# Altium schematic sheet LED_1edge.SchDoc
size A
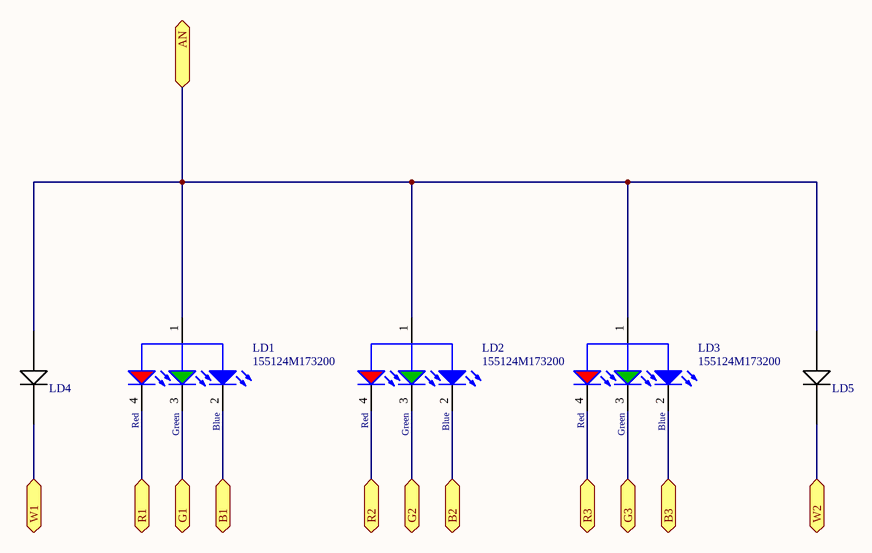
[diagram p0: LED_1edge.SchDoc]

## Parts
LD1  155124M173200  [WL-SFSW_1204]
LD2  155124M173200  [WL-SFSW_1204]
LD3  155124M173200  [WL-SFSW_1204]
LD4  LTW-008ZDCG  [LTW-008ZDCG]  (value not drawn)
LD5  LTW-008ZDCG  [LTW-008ZDCG]  (value not drawn)

## Ports
AN, B1, B2, B3, G1, G2, G3, R1, R2, R3, W1, W2

## Nets
AN: LD1.1(A) LD2.1(A) LD3.1(A) LD4.2(K) LD5.2(K) ; port AN
B1: LD1.2(K) ; port B1
B2: LD2.2(K) ; port B2
B3: LD3.2(K) ; port B3
G1: LD1.3(K) ; port G1
G2: LD2.3(K) ; port G2
G3: LD3.3(K) ; port G3
R1: LD1.4(K) ; port R1
R2: LD2.4(K) ; port R2
R3: LD3.4(K) ; port R3
W1: LD4.1(A) ; port W1
W2: LD5.1(A) ; port W2

## Notes on the sheet
- (in symbol 155124M173200) Red; Green; Blue

## Library data of the parts
LD1-LD3 = 155124M173200: WL-SFSW SMD Full-color Side view Waterclear; Viewing Angle: 120°; Emitting Color: Red & Green & Blue; Published Date: Jan 2017; Publisher: Wurth Elektronik; ComponentLink1Description: Manufacturer; ComponentLink1URL: http://www.we-online.de; ComponentLink2Description: Datasheet; ComponentLink2URL: http://katalog.we-online.de/led/datasheet/155124M173200.pdf; Part Number: 155124M173200; Size: 1204
LD4 LD5 = LTW-008ZDCG: LED WHITE 2SMD R/A